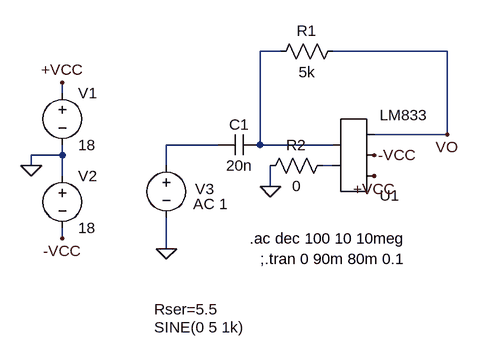
[diagram p0: schematic Derivador.asc]
Derivador.asc, the LTspice schematic file:
Version 4
SHEET 1 880 680
WIRE 128 -64 96 -64
WIRE 384 -64 208 -64
WIRE -208 0 -208 -16
WIRE 384 64 384 -64
WIRE 384 64 272 64
WIRE 32 80 -48 80
WIRE 96 80 96 -64
WIRE 208 80 96 80
WIRE -208 96 -208 80
WIRE -208 96 -256 96
WIRE -256 112 -256 96
WIRE -48 112 -48 80
WIRE 208 112 192 112
WIRE -208 128 -208 96
WIRE 112 144 112 112
WIRE -208 224 -208 208
WIRE -48 240 -48 192
FLAG -256 112 0
FLAG -208 -16 +VCC
FLAG -208 224 -VCC
FLAG 112 144 0
FLAG -48 240 0
FLAG 384 64 VO
FLAG 272 128 +VCC
FLAG 272 96 -VCC
SYMBOL voltage -208 -16 R0
WINDOW 123 0 0 Left 0
WINDOW 39 0 0 Left 0
SYMATTR InstName V1
SYMATTR Value 18
SYMBOL voltage -208 112 R0
WINDOW 123 0 0 Left 0
WINDOW 39 0 0 Left 0
SYMATTR InstName V2
SYMATTR Value 18
SYMBOL cap 96 64 R90
WINDOW 0 0 32 VBottom 2
WINDOW 3 32 32 VTop 2
SYMATTR InstName C1
SYMATTR Value 20n
SYMBOL res 224 -80 R90
WINDOW 0 0 56 VBottom 2
WINDOW 3 32 56 VTop 2
SYMATTR InstName R1
SYMATTR Value 5k
SYMBOL AutoGenerated\\LM833 240 96 M180
SYMATTR InstName U1
SYMBOL voltage -48 96 R0
WINDOW 3 -19 265 Left 2
WINDOW 123 41 75 Left 2
WINDOW 39 -19 237 Left 2
WINDOW 0 44 52 Left 2
SYMATTR Value SINE(0 5 1k)
SYMATTR Value2 AC 1
SYMATTR SpiceLine Rser=5.5
SYMATTR InstName V3
SYMBOL res 208 96 R90
WINDOW 0 0 56 VBottom 2
WINDOW 3 32 56 VTop 2
SYMATTR InstName R2
SYMATTR Value 0
TEXT 80 224 Left 2 !.ac dec 100 10 10meg
TEXT 96 256 Left 2 !;.tran 0 90m 80m 0.1

The netlist it stands for:
* Derivador.asc
V1 +VCC 0 18
V2 0 -VCC 18
C1 N001 N002 20n
R1 VO N001 5k
* U1: LM833 (symbol AutoGenerated\LM833 not available, pins judged from their places): pin1=N003 pin2=N001 pin3=+VCC pin4=-VCC pin5=VO
V3 N002 0 SINE(0 5 1k) AC 1 Rser=5.5
R2 N003 0 0
.ac dec 100 10 10meg
;.tran 0 90m 80m 0.1
.backanno
.end